# Altium schematic sheet CODEC and Headphone Jack.SchDoc: RK3399 COB Design V1.0
size A3; Author: AVIRAL MISHRA; DocumentNumber: 24; SheetNumber: 24; SheetTotal: 27; PROJECT CODE: A_V1.0
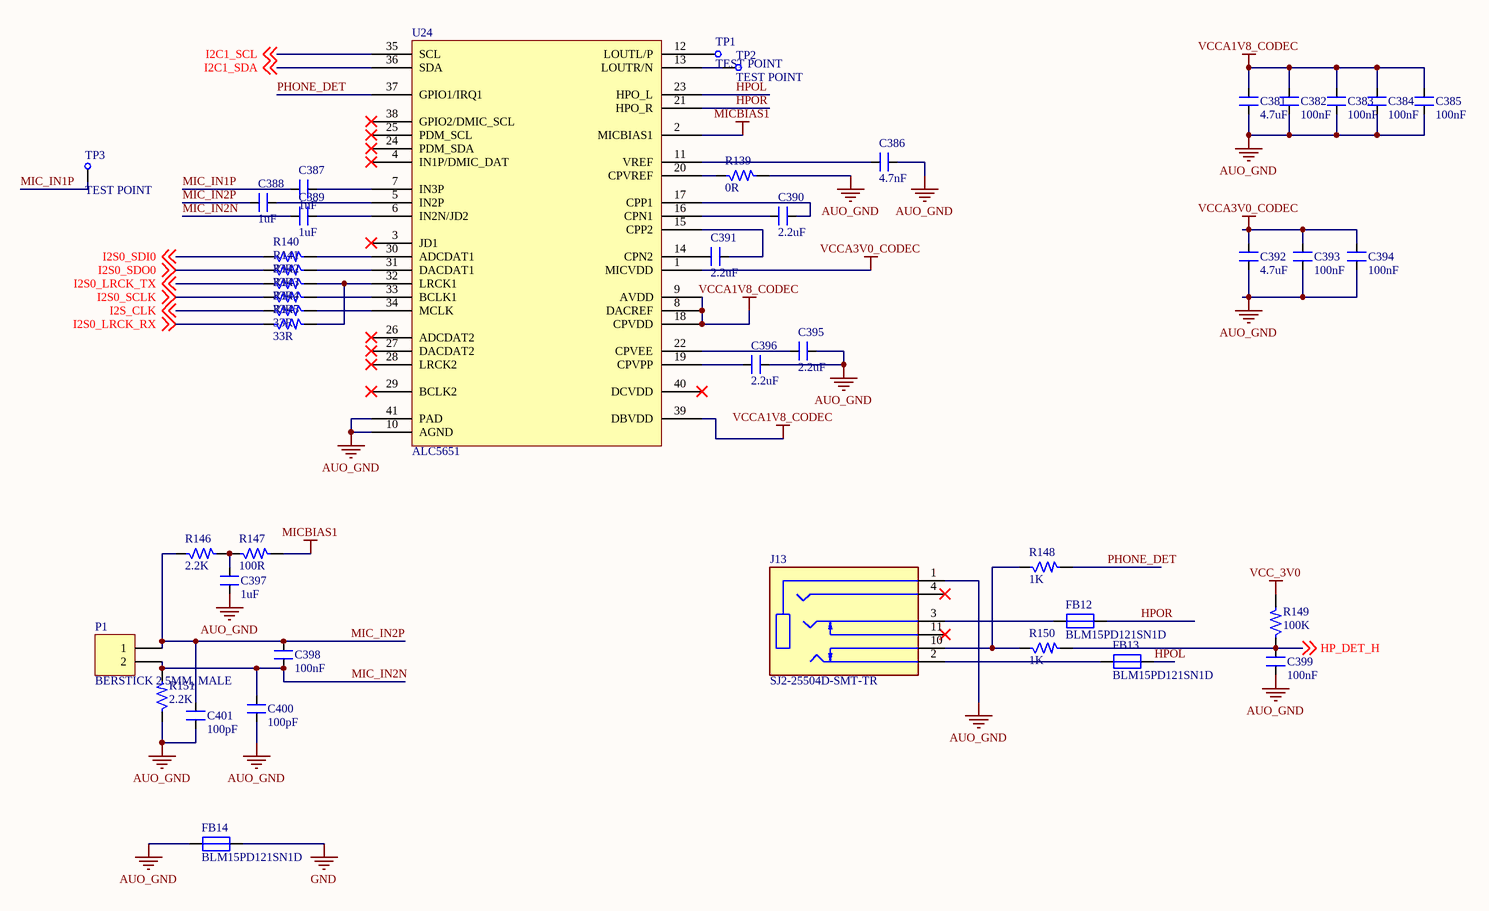
[diagram p0: CODEC and Headphone Jack.SchDoc]

## Parts
C381  4.7uF  [CAP_0603]
C382  100nF  [CAP_0603]
C383  100nF  [CAP_0603]
C384  100nF  [CAP_0603]
C385  100nF  [CAP_0603]
C386  4.7nF  [CAP_0603]
C387  1uF  [CAP_0402]
C388  1uF  [CAP_0402]
C389  1uF  [CAP_0402]
C390  2.2uF  [CAP_0402]
C391  2.2uF  [CAP_0402]
C392  4.7uF  [CAP_0603]
C393  100nF  [CAP_0603]
C394  100nF  [CAP_0603]
C395  2.2uF  [CAP_0402]
C396  2.2uF  [CAP_0402]
C397  1uF  [CAP_0603]
C398  100nF  [CAP_0603]
C399  100nF  [CAP_0603]
C400  100pF  [CAP_0603]
C401  100pF  [CAP_0603]
FB12  BLM15PD121SN1D  [RES_0402]
FB13  BLM15PD121SN1D  [RES_0402]
FB14  BLM15PD121SN1D  [RES_0402]
J13  SJ2-25504D-SMT-TR  [CON11_SJ2-25504D-SMT-TR_TH_RA]
P1  BERSTICK 2.5MM, MALE  [CON2_100_43D62_TH_ST]
R139  0R  [RES_0603]
R140  33R  [RES_0402]
R141  33R  [RES_0402]
R142  33R  [RES_0402]
R143  33R  [RES_0402]
R144  33R  [RES_0402]
R145  33R  [RES_0402]
R146  2.2K  [RES_0603]
R147  100R  [RES_0603]
R148  1K  [RES_0603]
R149  100K  [RES_0603]
R150  1K  [RES_0603]
R151  2.2K  [RES_0603]
TP1  TEST POINT  [TEST POINT_30]
TP2  TEST POINT  [TEST POINT_30]
TP3  TEST POINT  [TEST POINT_30]
U24  ALC5651  [QFN40_15.7_227X227_SMD]

## Nets
AUO_GND: C381.1 C382.1 C383.1 C384.1 C385.1 C386.2 C392.1 C393.1 C394.1 C395.2 C396.2 C397.1 C399.1 C400.1 C401.1 FB14.1 J13.1(SLEEVE) R139.2 R151.1 U24.10(AGND) U24.41(PAD)
GND: FB14.2
MICBIAS1: R147.2 U24.2(MICBIAS1)
VCC_3V0: R149.2
VCCA1V8_CODEC: C381.2 C382.2 C383.2 C384.2 C385.2 U24.8(DACREF) U24.9(AVDD) U24.18(CPVDD) U24.39(DBVDD)
VCCA3V0_CODEC: C392.2 C393.2 C394.2 U24.1(MICVDD)
HP_DET_H: C399.2 R149.1 R150.2 ; off-sheet HP_DET_H
HPOL: FB13.2 U24.23(HPO_L)
HPOR: FB12.2 U24.21(HPO_R)
I2C1_SCL: U24.35(SCL) ; off-sheet I2C1_SCL
I2C1_SDA: U24.36(SDA) ; off-sheet I2C1_SDA
I2S0_LRCK_RX: R145.1 ; off-sheet I2S0_LRCK_RX
I2S0_LRCK_TX: R142.1 ; off-sheet I2S0_LRCK_TX
I2S0_SCLK: R143.1 ; off-sheet I2S0_SCLK
I2S0_SDI0: R140.1 ; off-sheet I2S0_SDI0
I2S0_SDO0: R141.1 ; off-sheet I2S0_SDO0
I2S_CLK: R144.1 ; off-sheet I2S_CLK
MIC_IN1P: C387.1 TP3.1
MIC_IN2N: C389.1 C398.1 C400.2 P1.2 R151.2
MIC_IN2P: C388.1 C398.2 C401.2 P1.1 R146.1
PHONE_DET: R148.2 U24.37(GPIO1/IRQ1)
NetC386_1: C386.1 U24.11(VREF)
NetC387_2: C387.2 U24.7(IN3P)
NetC388_2: C388.2 U24.5(IN2P)
NetC389_2: C389.2 U24.6(IN2N/JD2)
NetC390_1: C390.1 U24.16(CPN1)
NetC390_2: C390.2 U24.17(CPP1)
NetC391_1: C391.1 U24.14(CPN2)
NetC391_2: C391.2 U24.15(CPP2)
NetC395_1: C395.1 U24.22(CPVEE)
NetC396_1: C396.1 U24.19(CPVPP)
NetC397_2: C397.2 R146.2 R147.1
NetFB12_1: FB12.1 J13.3(RING1)
NetFB13_1: FB13.1 J13.2(TIP)
NetJ13_10: J13.10(TIP_SWITCH) R148.1 R150.1
NetR139_1: R139.1 U24.20(CPVREF)
NetR140_2: R140.2 U24.30(ADCDAT1)
NetR141_2: R141.2 U24.31(DACDAT1)
NetR142_2: R142.2 R145.2 U24.32(LRCK1)
NetR143_2: R143.2 U24.33(BCLK1)
NetR144_2: R144.2 U24.34(MCLK)
NetTP1_1: TP1.1 U24.12(LOUTL/P)
NetTP2_1: TP2.1 U24.13(LOUTR/N)

Not connected (* = marked no-connect by the designer): J13 4(RING2)* 11(RING1_SWITCH)*; U24 3(JD1)* 4(IN1P/DMIC_DAT)* 24(PDM_SDA)* 25(PDM_SCL)* 26(ADCDAT2)* 27(DACDAT2)* 28(LRCK2)* 29(BCLK2)* 38(GPIO2/DMIC_SCL)* 40(DCVDD)*

## Notes on the sheet
- TITLE:
- DOCUMENT NAME:
- SCALE 1:1
- This document is copyright of EsteemPCB and shall not be revealed, produced, copied, in whole or in part, nor
- PROJECT CODE:
- TEMPLATE:
- A4
- AUTHOR:
- Sheet
- of
- used for any purpose other than submitted.

## Library data of the parts
C381 C392 = CAP_4.7uF-16V-10%-0603: 4.7µF ±10% 16V Ceramic Capacitor X5R 0603 (1608 Metric) /; Manufacturer: Murata Electronics; Manufacturer Part Number: GRM188R61C475KAAJD; Case/Package: 0603; Supplier-1: Digikey
C382-C385 C393 C394 C398 C399 = CAP_100nF-10V-5%-0603: 0.1µF ±10% 10V Ceramic Capacitor X7R 0603 (1608 Metric) /; Manufacturer: Yageo; Manufacturer Part Number: CC0603KRX7R6BB104; Case/Package: 0603; Supplier-1: Digikey
C386 = CAP_4.7nF-10V-10%-0603: 4700pF ±10% 10V Ceramic Capacitor X7R 0603 (1608 Metric) /; Manufacturer: KEMET; Manufacturer Part Number: C0603C472K8RACTU; Case/Package: 0603; Supplier-1: Digikey
C387-C389 = CAP_1uF-10V-10%-0402: 1µF ±10% 10V Ceramic Capacitor X6S 0402 (1005 Metric) /; Manufacturer: Murata Electronics; Manufacturer Part Number: GRT155C81A105KE01D; Case/Package: 0402; Supplier-1: Digikey
C390 C391 C395 C396 = CAP_2.2uF-10V-10%-0402: 2.2µF ±10% 10V Ceramic Capacitor X5R 0402 (1005 Metric) /; Manufacturer: Murata Electronics; Manufacturer Part Number: GRM155R61A225KE95D; Case/Package: 0402; Supplier-1: Digikey
C397 = CAP_1uF-10V-5%-0603: 1µF ±10% 10V Ceramic Capacitor X5R 0603 (1608 Metric) /; Manufacturer: Samsung Electro-Mechanics; Manufacturer Part Number: CL10A105KP8NNNC; Case/Package: 0603; Supplier-1: Digikey
C400 C401 = CAP_100pF-10V-10%-0603: 100pF ±10% 10V Ceramic Capacitor X7R 0603 (1608 Metric) /; Manufacturer: AVX Corporation; Manufacturer Part Number: 0603ZC101KAT2A; Case/Package: 0603; Supplier-1: Digikey
FB12-FB14 = FB_120R-1.3A-100Mhz-0402: 120 Ohms @ 100MHz 1 Power Line Ferrite Bead 0402 (1005 Metric) 1.3A 90mOhm; Manufacturer: Murata Electronics; Mnaufacturer Part Number: BLM15PD121SN1D; Case/Package: 0402; Supplier-1: Digikey
J13 = CON-PLG_SJ2-25504D-SMT-TR-RA-TH: 2.5 mm, Stereo, Right Angle, Surface Mount (SMT), 4 Conductors, 2 Internal Switches, Audio Jack Connector; Manufacturer: CUI Devices; Manufacturer Part Number: SJ2-25504D-SMT-TR; Case/Package: SMD; Supplier-1: Digikey
P1 = CON-BS-PLG_2X1-100-ST-TH: 2 Pins, 1 Row 2.54mm Pitch, Straight bergstrip, Male; Manufacturer Part Number: NA; Manufacturer: Samtec; Case/Package: TH-CON; Supplier-1: SP ROAD
R139 = RES_0R-0.1W-1%-0603: 0 Ohms Jumper 0.1W, 1/10W Chip Resistor 0603 (1608 Metric) Thick Film; Manufacturer: Yageo; Manufacturer Part Number: RC0603JR-070RL; Case/Package: 0603; Supplier-1: Digikey
R140-R145 = RES_33R-0.1W-1%-0402: 33 Ohms ±1% 0.1W, 1/10W Chip Resistor 0402 (1005 Metric) Automotive AEC-Q200 Thick Film /; Manufacturer: Panasonic Electronic Components; Manufacturer Part Number: ERJ-2RKF33R0X; Case/Package: 0402; Supplier-1: Digikey
R146 R151 = RES_2.2K-0.1W-1%-0603: 2.2 kOhms ±1% 0.1W, 1/10W Chip Resistor 0603 (1608 Metric) Thick Film /; Manufacturer: Yageo; Manufacturer Part Number: RC0603FR-072K2L; Case/Package: 0603; Supplier-1: Digikey
R147 = RES_100R-0.1W-1%-0603: 100 Ohms ±1% 0.1W, 1/10W Chip Resistor 0603 (1608 Metric) Thick Film /; Manufacturer: Yageo; Manufacturer Part Number: RC0603FR-07100RL; Case/Package: 0603; Supplier-1: Digikey
R148 R150 = RES_1K-0.1W-1%-0603: 1 kOhms ±1% 0.1W, 1/10W Chip Resistor 0603 (1608 Metric) Thick Film /; Manufacturer: Yageo; Manufacturer Part Number: RC0603FR-071KL; Case/Package: 0603; Supplier-1: Digikey
R149 = RES_100K-0.1W-1%-0603: 100 kOhms ±1% 0.1W, 1/10W Chip Resistor 0603 (1608 Metric) Automotive AEC-Q200 Thick Film /; Manufacturer: tackpole Electronics Inc; Manufacturer Part Number: RMCF0603FT100K; Case/Package: 0603; Supplier-1: Digikey
TP1-TP3 = TEST POINT: 0.4mm hole size Test point; Manufacturer Part Number: NA; Case/Package: TH; Manufacturer: NA; Supplier-1: NA
U24 = IC_ALC5651: Ultra-Low Power Two-Channel Audio CODEC / with SounzRealTM Digital Sound Effect / for Mobile Devices; Manufacturer: Realtek; Manufacturer Part Number: ALC5651; Case/Package: PQFA-45; Supplier-1: NA